# EAGLE design zero_board (EAGLE 6.6.0)
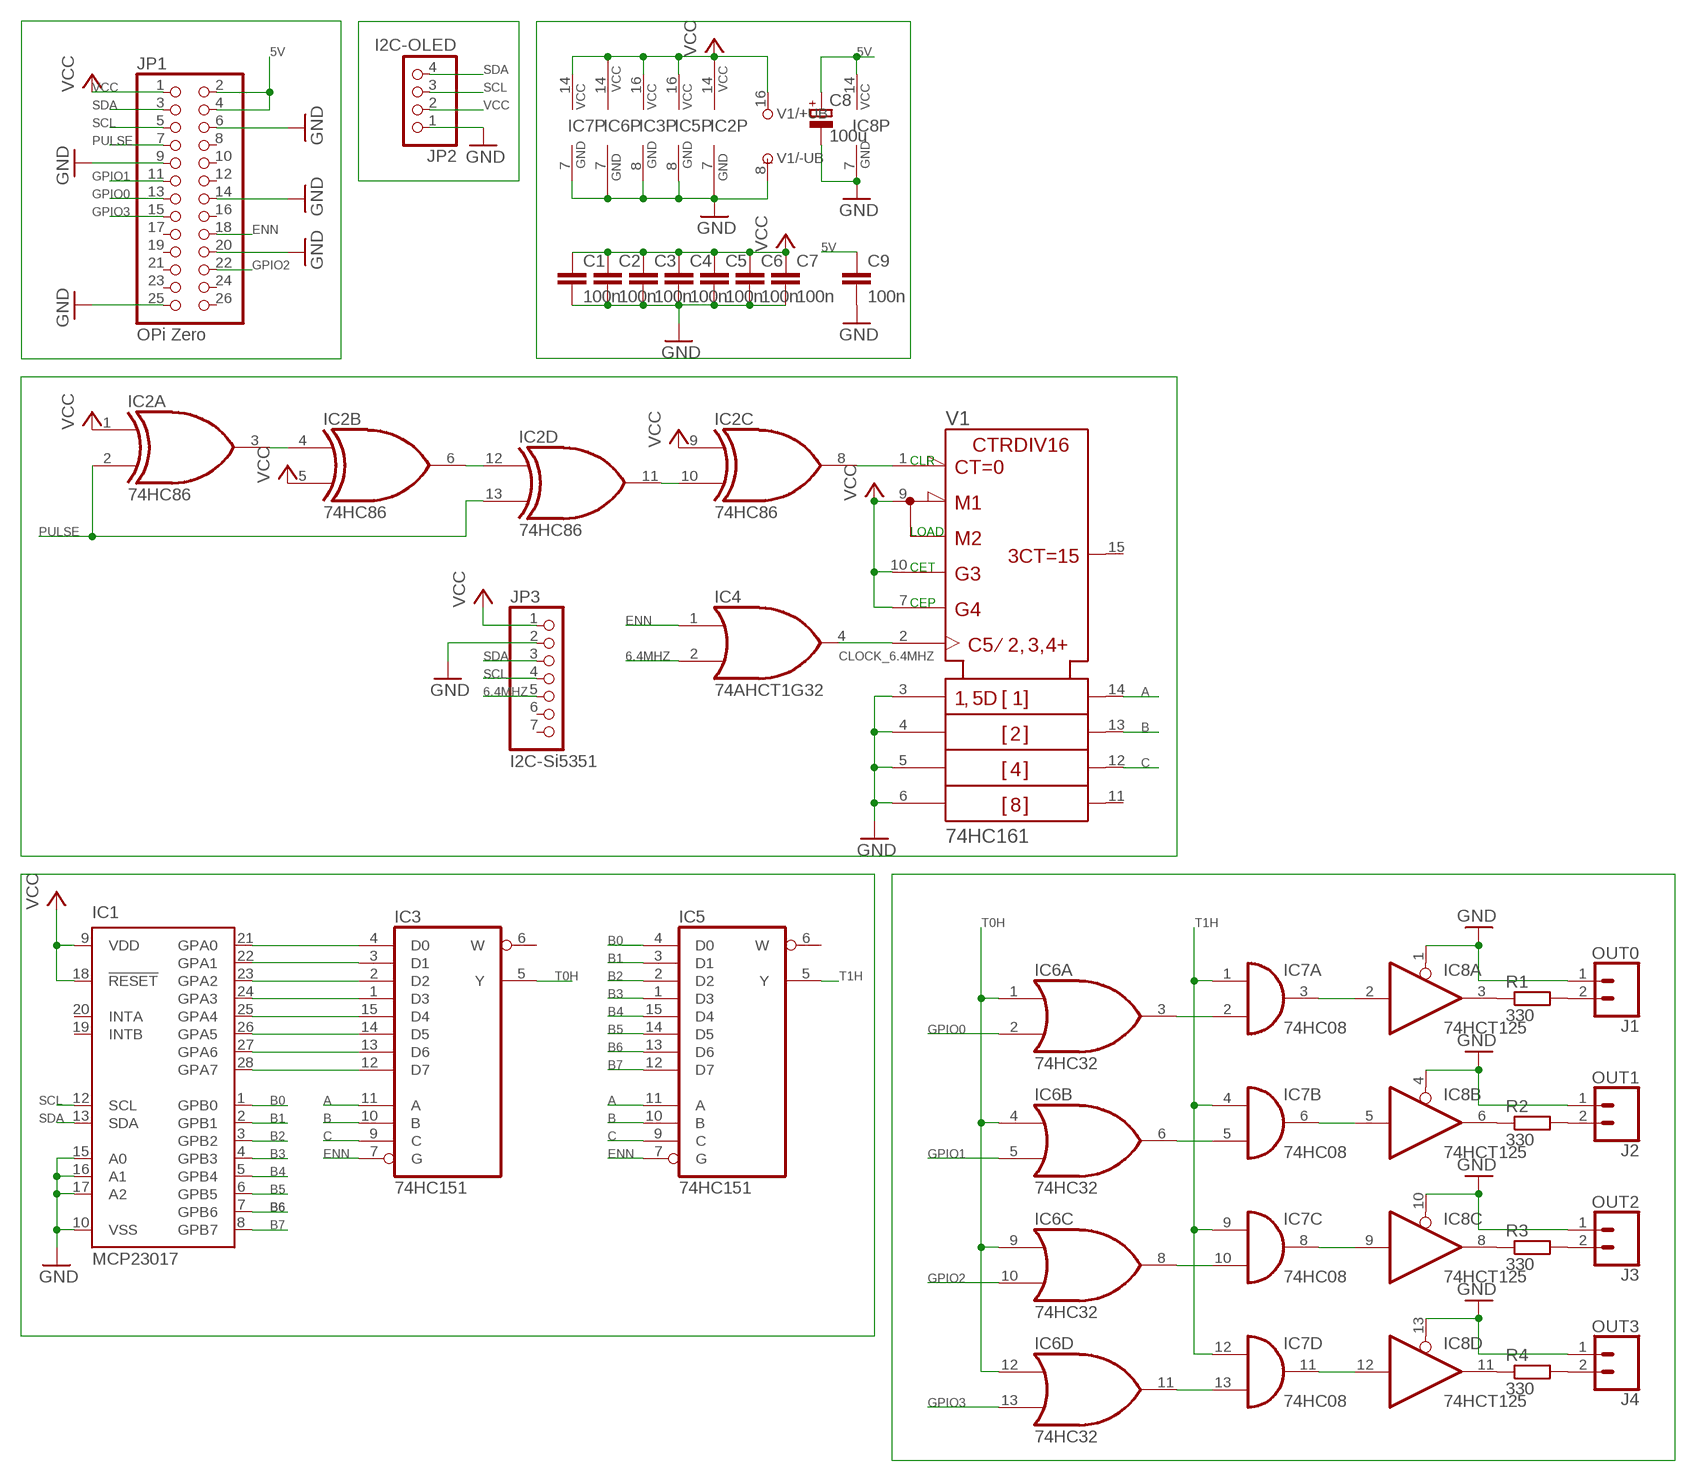
[diagram p0: schematic, sheet 1]

## Parts
C1  100n  C-EU050-024X044  [C050-024X044]
C2  100n  C-EU050-024X044  [C050-024X044]
C3  100n  C-EU050-024X044  [C050-024X044]
C4  100n  C-EU050-024X044  [C050-024X044]
C5  100n  C-EU050-024X044  [C050-024X044]
C6  100n  C-EU050-024X044  [C050-024X044]
C7  100n  C-EU050-024X044  [C050-024X044]
C8  100u  CPOL-EUE2.5-6  [E2,5-6]
C9  100n  C-EU050-024X044  [C050-024X044]
IC1  MCP23017  MCP23017SP  [DIL28-3]
IC2  74HC86  74LS86N  [DIL14]
IC3  74HC151  74HC151N  [DIL16]
IC4  74AHCT1G32  74AHCT1G32DBV  [SOT23-5]
IC5  74HC151  74HC151N  [DIL16]
IC6  74HC32  74LS32N  [DIL14]
IC7  74HC08  74AS08N  [DIL14]
IC8  74HCT125  74HC125N  [DIL14]
J1  OUT0  CONN_023.5MM  [SCREWTERMINAL-3.5MM-2]
J2  OUT1  CONN_023.5MM  [SCREWTERMINAL-3.5MM-2]
J3  OUT2  CONN_023.5MM  [SCREWTERMINAL-3.5MM-2]
J4  OUT3  CONN_023.5MM  [SCREWTERMINAL-3.5MM-2]
JP1  OPi Zero  PINHD-2X13  [2X13]
JP2  I2C-OLED  PINHD-1X4  [1X04]
JP3  I2C-Si5351  PINHD-1X7  [1X07]
R1  330  R-EU_0204/5  [0204/5]
R2  330  R-EU_0204/5  [0204/5]
R3  330  R-EU_0204/5  [0204/5]
R4  330  R-EU_0204/5  [0204/5]
V1  74HC161  74161N  [DIL16]

## Nets
5V: C8.+ C9.1 IC8.14(P:VCC) JP1.2 JP1.4
6.4MHZ: IC4.2(I1) JP3.5
A: IC3.11(A) IC5.11(A) V1.14(QA)
B: IC3.10(B) IC5.10(B) V1.13(QB)
B0: IC1.1(GPB0) IC5.4(D0)
B1: IC1.2(GPB1) IC5.3(D1)
B2: IC1.3(GPB2) IC5.2(D2)
B3: IC1.4(GPB3) IC5.1(D3)
B4: IC1.5(GPB4) IC5.15(D4)
B5: IC1.6(GPB5) IC5.14(D5)
B6: IC1.7(GPB6) IC5.13(D6)
B7: IC1.8(GPB7) IC5.12(D7)
C: IC3.9(C) IC5.9(C) V1.12(QC)
CLOCK_6.4MHZ: IC4.4(O) V1.2(CLK)
ENN: IC3.7(G) IC4.1(I0) IC5.7(G) JP1.18
GND: C1.2 C2.2 C3.2 C4.2 C5.2 C6.2 C7.2 C8.- C9.2 IC1.10(VSS) IC1.15(A0) IC1.16(A1) IC1.17(A2) IC2.7(P:GND) IC3.8(GND) IC5.8(GND) IC6.7(P:GND) IC7.7(P:GND) IC8.1(A:OE) IC8.4(B:OE) IC8.7(P:GND) IC8.10(C:OE) IC8.13(D:OE) J1.1 J2.1 J3.1 J4.1 JP1.6 JP1.9 JP1.14 JP1.20 JP1.25 JP2.1 JP3.2 V1.3(A) V1.4(B) V1.5(C) V1.6(D) V1.8(-UB)
GPIO0: IC6.2(A:I1) JP1.13
GPIO1: IC6.5(B:I1) JP1.11
GPIO2: IC6.10(C:I1) JP1.22
GPIO3: IC6.13(D:I1) JP1.15
N$1: IC2.3(A:O) IC2.4(B:I0)
N$2: IC2.6(B:O) IC2.12(D:I0)
N$3: IC2.10(C:I1) IC2.11(D:O)
N$4: IC2.8(C:O) V1.1(!CLR)
N$5: IC6.3(A:O) IC7.2(A:I1)
N$6: IC6.6(B:O) IC7.5(B:I1)
N$7: IC1.21(GPA0) IC3.4(D0)
N$8: IC1.22(GPA1) IC3.3(D1)
N$9: IC1.23(GPA2) IC3.2(D2)
N$10: IC1.24(GPA3) IC3.1(D3)
N$11: IC1.25(GPA4) IC3.15(D4)
N$12: IC1.26(GPA5) IC3.14(D5)
N$13: IC1.27(GPA6) IC3.13(D6)
N$14: IC1.28(GPA7) IC3.12(D7)
N$15: IC6.8(C:O) IC7.10(C:I1)
N$16: IC6.11(D:O) IC7.13(D:I1)
N$17: IC7.11(D:O) IC8.12(D:I)
N$18: IC7.8(C:O) IC8.9(C:I)
N$19: IC7.6(B:O) IC8.5(B:I)
N$20: IC7.3(A:O) IC8.2(A:I)
N$21: IC8.3(A:O) R1.1
N$22: J1.2 R1.2
N$23: IC8.6(B:O) R2.1
N$24: J2.2 R2.2
N$25: IC8.8(C:O) R3.1
N$26: J3.2 R3.2
N$27: IC8.11(D:O) R4.1
N$28: J4.2 R4.2
PULSE: IC2.2(A:I1) IC2.13(D:I1) JP1.7
SCL: IC1.12(SCL) JP1.5 JP2.3 JP3.4
SDA: IC1.13(SDA) JP1.3 JP2.4 JP3.3
T0H: IC3.5(Y) IC6.1(A:I0) IC6.4(B:I0) IC6.9(C:I0) IC6.12(D:I0)
T1H: IC5.5(Y) IC7.1(A:I0) IC7.4(B:I0) IC7.9(C:I0) IC7.12(D:I0)
VCC: C1.1 C2.1 C3.1 C4.1 C5.1 C6.1 C7.1 IC1.9(VDD) IC1.18(!RESET) IC2.1(A:I0) IC2.5(B:I1) IC2.9(C:I0) IC2.14(P:VCC) IC3.16(VCC) IC5.16(VCC) IC6.14(P:VCC) IC7.14(P:VCC) JP1.1 JP2.2 JP3.1 V1.7(ENP) V1.9(!LOAD) V1.10(ENT) V1.16(+UB)
Unconnected: IC1.19(INTB) IC1.20(INTA) IC3.6(W) IC5.6(W) JP1.8 JP1.10 JP1.12 JP1.16 JP1.17 JP1.19 JP1.21 JP1.23 JP1.24 JP1.26 JP3.6 JP3.7 V1.11(QD) V1.15(RCO)

## Notes on the sheet
- CLR
- LOAD
- CET
- CEP

## Power pins joined to a net without a drawn wire
GND: IC4.3(GND)
VCC: IC4.5(VCC)

## Library data of the parts
C1-C7 C9 = rcl:C-EU: CAPACITOR, European symbol
C8 = rcl:CPOL-EU: POLARIZED CAPACITOR, European symbol
IC1 = microchip:MCP23017: http://ww1.microchip.com/downloads/en/DeviceDoc/21952a.pdf Source: http://ww1.microchip.com/downloads/en/DeviceDoc/21952a.pdf; MF: MICROCHIP; MPN: MCP23017-E/SP; OC_FARNELL: 1332088; OC_NEWARK: 31K2959
IC2 = 74xx-us:74*86: Quad 2-input EXCLUSIV-OR (XOR) gate
IC3 IC5 = 74xx-eu:74*151: Data SELECTOR/MULTIPLEXER
IC4 = 74xx-little-us:74*1G32: 2-input OR gate
IC6 = 74xx-us:74*32: Quad 2-input OR gate
IC7 = 74xx-eu:74*08: Quad 2-input AND gate
IC8 = 74xx-eu:74*125: Quad bus BUFFER, 3-state
J1-J4 = SparkFun-Connectors:CONN_02: Multi connection point. Often used as Generic Header-pin footprint for 0.1 inch spaced/style header connections On any of the 0.1 inch spaced packages, you can populate with these: Break Away Headers - Straight <https://www.sparkfun.com/products/116> (PRT-00116) Break Away Male Headers - Right Angle <https://www.sparkfun.com/products/553> (PRT-00553) Female Headers <https://www.sparkfun.com/products/115> (PRT-00115) Break Away Headers - Machine Pin <https://www.sparkfun.com/products/117> (PRT-00117) Break Away Female Headers - Swiss Machine Pin <https://www.sparkfun.com/products/743> (PRT-00743) For SCREWTERMINALS and SPRING TERMINALS visit here: Screw Terimnals on SparkFun.com <https://www.sparkfun.com/search/results?term=Screw+Terminals> (5mm/3.5mm/2.54mm spacing) This device is also useful as a general connection point to wire up your design to another part of your project. Our various solder wires solder well into these plated through hole pads. Hook-Up Wire - Assortment (Stranded, 22 AWG) <https://www.sparkfun.com/products/11375> (PRT-11375) Hook-Up Wire - Assortment (Solid Core, 22 AWG) <https://www.sparkfun.com/products/11367> (PRT-11367) View the entire wire category on our website here <https://www.sparkfun.com/categories/141> Special notes: Molex polarized connector foot print use with: PRT-08233 with associated crimp pins and housings. 2.54_SCREWTERM for use with PRT-10571. 3.5mm Screw Terminal footprints for PRT-08084 5mm Screw Terminal footprints for use with PRT-08432; PROD_ID: CONN-08399
JP1 = pinhead:PINHD-2X13: PIN HEADER
JP2 = pinhead:PINHD-1X4: PIN HEADER
JP3 = pinhead:PINHD-1X7: PIN HEADER
R1-R4 = resistor:R-EU_: RESISTOR, European symbol
V1 = 74ttl-din:74*161: Synchrounus 4-bit COUNTER

## Board
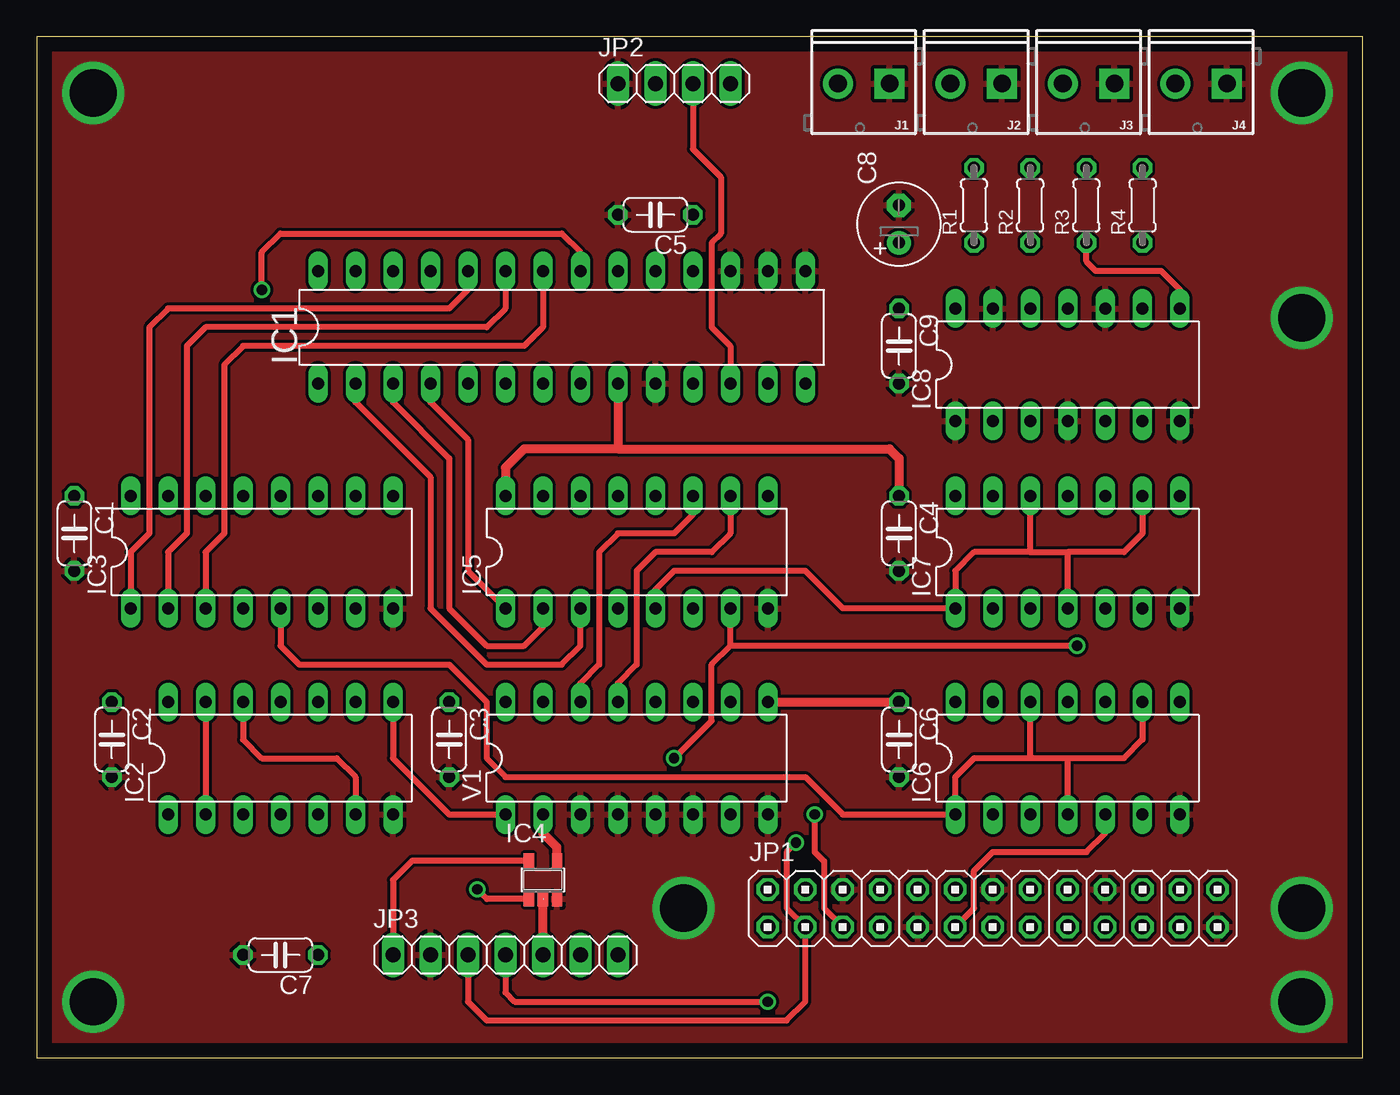
[diagram p1: board, top side]
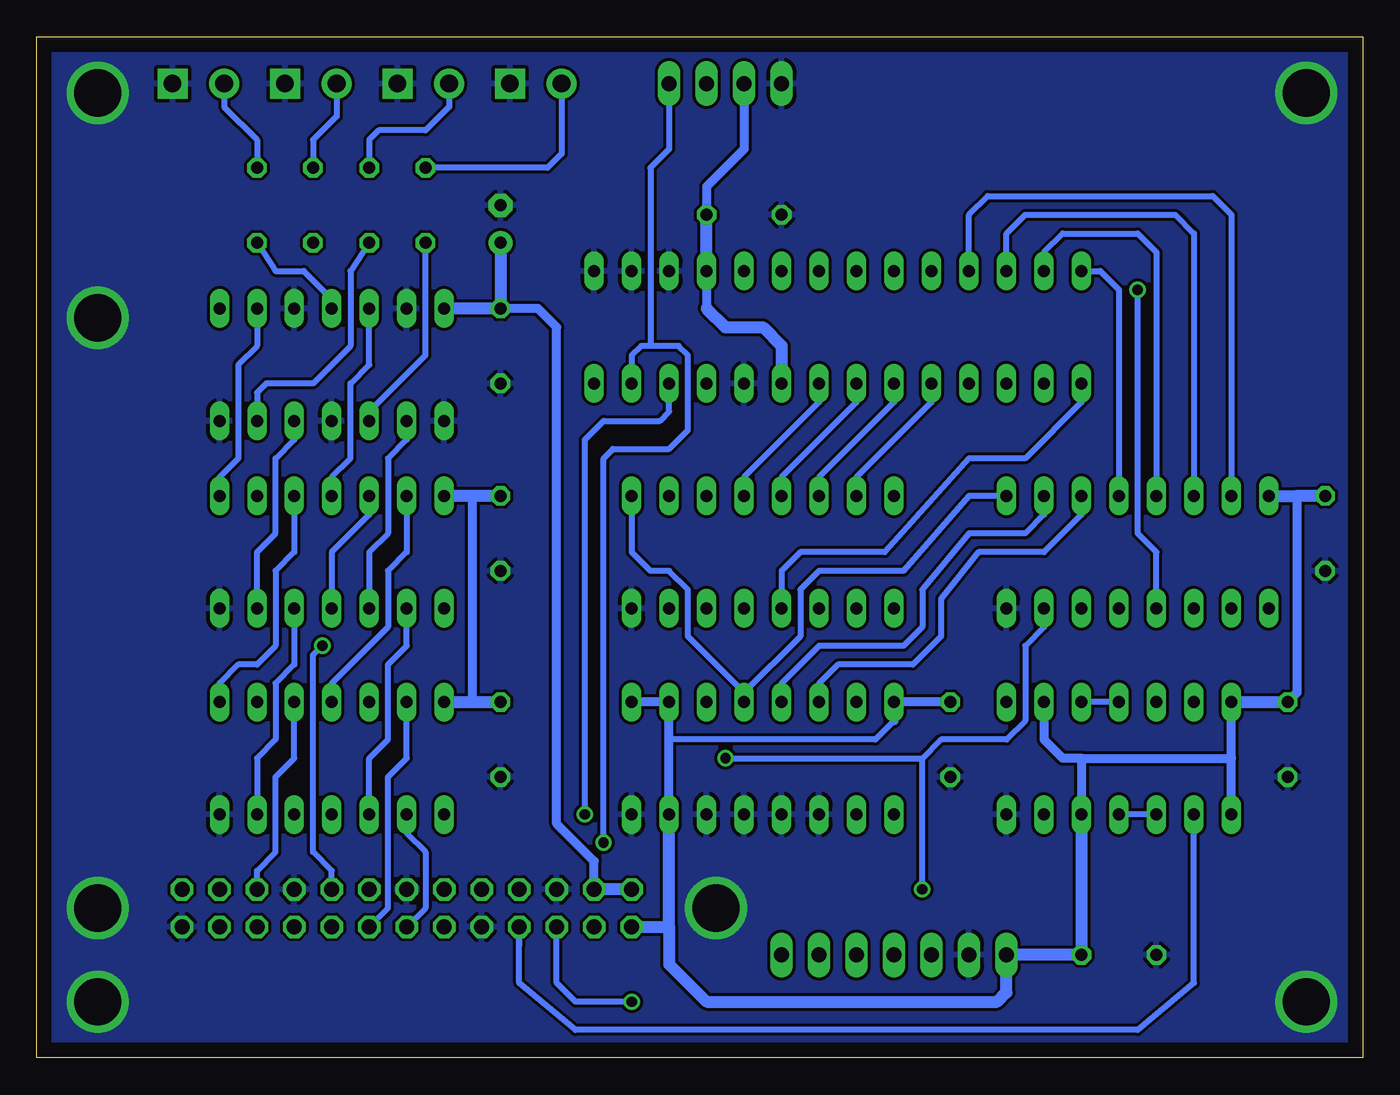
[diagram p2: board, bottom side, seen from below]

Size 89.84 x 69.2 mm. Coordinates in mm from the lower left corner, seen from the top.
Outline: 0,0 89.84,0 89.84,69.2 0,69.2 0,0
Copper layers (1*16): Top 0.035mm / dielectric 1.5mm / Bottom 0.035mm
Design rules "default": minimum track width 10mil, minimum drill 24mil, track to track 8mil, track to pad 8mil, pad to pad 8mil, via to via 8mil, smd to smd 8mil, copper to edge 40mil, drill to drill 8mil, minimum pad ring 10mil, minimum via ring 8mil, stop-mask expansion 4mil, vias tented up to drill 0mil, thermal gap 10mil

### Footprints (pad centres in the part's own frame; a part is rotated, then mirrored left to right if it is on the bottom)
C050-024X044 = drill 0.813 octagon: 1 -2.54,0; 2 2.54,0
E2,5-6 = drill 0.813 pad 1.6: + -1.27,0 | drill 0.813 pad 1.6 octagon: - 1.27,0
DIL28-3 = drill 0.813 long: 1 -16.51,-3.81; 2 -13.97,-3.81; 3 -11.43,-3.81; 4 -8.89,-3.81; 5 -6.35,-3.81; 6 -3.81,-3.81; 7 -1.27,-3.81; 8 1.27,-3.81; 9 3.81,-3.81; 10 6.35,-3.81; 11 8.89,-3.81; 12 11.43,-3.81; 13 13.97,-3.81; 14 16.51,-3.81; 15 16.51,3.81; 16 13.97,3.81; 17 11.43,3.81; 18 8.89,3.81; 19 6.35,3.81; 20 3.81,3.81; 21 1.27,3.81; 22 -1.27,3.81; 23 -3.81,3.81; 24 -6.35,3.81; 25 -8.89,3.81; 26 -11.43,3.81; 27 -13.97,3.81; 28 -16.51,3.81
DIL14 = drill 0.813 long: 1 -7.62,-3.81; 2 -5.08,-3.81; 3 -2.54,-3.81; 4 0,-3.81; 5 2.54,-3.81; 6 5.08,-3.81; 7 7.62,-3.81; 8 7.62,3.81; 9 5.08,3.81; 10 2.54,3.81; 11 0,3.81; 12 -2.54,3.81; 13 -5.08,3.81; 14 -7.62,3.81
DIL16 = drill 0.813 long: 1 -8.89,-3.81; 2 -6.35,-3.81; 3 -3.81,-3.81; 4 -1.27,-3.81; 5 1.27,-3.81; 6 3.81,-3.81; 7 6.35,-3.81; 8 8.89,-3.81; 9 8.89,3.81; 10 6.35,3.81; 11 3.81,3.81; 12 1.27,3.81; 13 -1.27,3.81; 14 -3.81,3.81; 15 -6.35,3.81; 16 -8.89,3.81
SOT23-5 = smd 0.69 x 0.99: 1 -0.95,-1.29; 2 0,-1.29; 3 0.95,-1.29; 4 0.95,1.3; 5 -0.95,1.3
SCREWTERMINAL-3.5MM-2 = drill 1.2 pad 2.032 square: 1 0,0 | drill 1.2 pad 2.032: 2 3.5,0
2X13 = drill 1.016 octagon: 1 -15.24,-1.27; 2 -15.24,1.27; 3 -12.7,-1.27; 4 -12.7,1.27; 5 -10.16,-1.27; 6 -10.16,1.27; 7 -7.62,-1.27; 8 -7.62,1.27; 9 -5.08,-1.27; 10 -5.08,1.27; 11 -2.54,-1.27; 12 -2.54,1.27; 13 0,-1.27; 14 0,1.27; 15 2.54,-1.27; 16 2.54,1.27; 17 5.08,-1.27; 18 5.08,1.27; 19 7.62,-1.27; 20 7.62,1.27; 21 10.16,-1.27; 22 10.16,1.27; 23 12.7,-1.27; 24 12.7,1.27; 25 15.24,-1.27; 26 15.24,1.27
1X04 = drill 1.016 long: 1 -3.81,0; 2 -1.27,0; 3 1.27,0; 4 3.81,0
1X07 = drill 1.016 long: 1 -7.62,0; 2 -5.08,0; 3 -2.54,0; 4 0,0; 5 2.54,0; 6 5.08,0; 7 7.62,0
0204/5 = drill 0.813 octagon: 1 -2.54,0; 2 2.54,0

### Placement (x,y rotation side)
C1  2.54,35.56 270 top
C2  5.08,21.59 270 top
C3  27.94,21.59 270 top
C4  58.42,35.56 270 top
C5  41.91,57.15 180 top
C6  58.42,21.59 270 top
C7  16.51,6.99 180 top
C8  58.42,56.52 90 top
C9  58.42,48.26 270 top
IC1  35.56,49.53 0 top
IC2  16.51,20.32 0 top
IC3  15.24,34.29 0 top
IC4  34.29,12.07 0 top
IC5  40.64,34.29 0 top
IC6  69.85,20.32 0 top
IC7  69.85,34.29 0 top
IC8  69.85,46.99 0 top
J1  57.78,66.04 180 top
J2  65.41,66.04 180 top
J3  73.03,66.04 180 top
J4  80.65,66.04 180 top
JP1  64.77,10.16 0 top
JP2  43.18,66.04 0 top
JP3  31.75,6.99 0 top
R1  63.5,57.78 90 top
R2  67.31,57.78 90 top
R3  71.12,57.78 90 top
R4  74.93,57.78 90 top
V1  40.64,20.32 0 top

### Tracks (layer width: path | path; a pad name or v marks a point on that pad's centre or on a via)
5V
  Bottom 0.61: JP1.4 52.07,13.34 54.61,15.88 54.61,49.53 55.88,50.8 C9.1
  Bottom 0.813: IC8.14 C9.1 C8.+ | JP1.2 JP1.4
6.4MHZ
  Top 0.61: JP3.5 IC4.2
A
  Top 0.406: IC5.11 44.45,36.83 43.18,35.56 39.37,35.56 38.1,34.29 38.1,26.67 36.83,25.4 V1.14
  Bottom 0.406: IC3.11 19.05,36.83 21.59,34.29 26.04,34.29 28.58,31.12 28.58,28.57 30.48,26.67 35.56,26.67 36.83,25.4 V1.14
B
  Top 0.406: IC5.10 46.99,35.56 45.72,34.29 41.91,34.29 40.64,33.02 40.64,26.67 39.37,25.4 V1.13
  Bottom 0.406: IC3.10 21.59,36.83 22.86,35.56 26.67,35.56 29.85,31.75 29.85,29.21 31.12,27.94 36.83,27.94 39.37,25.4 V1.13
B0
  Bottom 0.406: IC1.1 19.05,44.45 22.86,40.64 26.67,40.64 32.38,34.29 38.1,34.29 39.37,33.02 IC5.4
B1
  Top 0.406: IC5.3 36.83,27.94 35.56,26.67 30.48,26.67 26.67,30.48 26.67,39.37 21.59,44.45 IC1.2
B2
  Top 0.406: IC5.2 34.29,29.21 33.02,27.94 30.48,27.94 27.94,30.48 27.94,40.64 24.13,44.45 IC1.3
B3
  Top 0.406: IC1.4 26.67,44.45 29.21,41.91 29.21,33.02 IC5.1
B4
  Bottom 0.406: IC1.5 29.21,44.45 34.29,39.37 IC5.15
B5
  Bottom 0.406: IC1.6 31.75,44.45 36.83,39.37 IC5.14
B6
  Bottom 0.406: IC1.7 34.29,44.45 39.37,39.37 IC5.13
B7
  Bottom 0.406: IC1.8 36.83,44.45 41.91,39.37 IC5.12
C
  Bottom 0.406: IC3.9 26.67,38.1 31.12,33.02 36.83,33.02 38.1,31.75 38.1,28.57 41.91,24.77 | IC5.9 49.53,34.29 48.26,33.02 46.99,33.02 45.72,31.75 45.72,28.57 41.91,24.77 | 41.91,24.77 V1.12
CLOCK_6.4MHZ
  Top 0.61: IC4.4 35.24,14.29 34.29,15.24 V1.2
ENN  (via drill 0.7)
  Top 0.406: 46.99,27.94 45.72,26.67 45.72,22.86 v43.18,20.32 | 46.99,27.94 IC5.7 | v70.48,27.94 46.99,27.94 | IC4.1 30.5,10.78 v29.85,11.43
  Bottom 0.406: IC3.7 21.59,29.21 22.86,27.94 22.86,22.86 24.13,21.59 28.58,21.59 29.85,20.32 | v43.18,20.32 29.85,20.32 | JP1.18 69.85,12.7 71.12,13.97 71.12,27.3 v70.48,27.94 | v29.85,11.43 29.85,20.32
GND  (via drill 3.2)
  other vias: 85.73,3.81 3.81,3.81 3.81,65.41 85.73,65.41 85.73,10.16 43.81,10.16 85.73,50.16
  pour Bottom: -1.27,-0.64 90.81,-0.64 90.81,69.85 -0.64,69.85
  pour Top: -0.64,-0.64 90.17,-0.64 90.17,69.22 -0.64,69.22
GPIO0
  Bottom 0.406: IC6.2 64.77,15.24 63.5,13.97 63.5,10.16 JP1.13
GPIO1
  Top 0.406: JP1.11 63.5,10.16 63.5,12.7 64.77,13.97 71.12,13.97 72.39,15.24 IC6.5
GPIO2
  Bottom 0.406: JP1.22 74.93,12.7 73.66,13.97 73.66,19.05 72.39,20.32 IC6.10
GPIO3
  Bottom 0.406: JP1.15 66.04,10.16 66.04,19.05 64.77,20.32 IC6.13
N$1
  Bottom 0.406: IC2.3 IC2.4
N$2
  Top 0.406: IC2.12 13.97,21.59 15.24,20.32 20.32,20.32 21.59,19.05 IC2.6
N$3
  Bottom 0.406: IC2.11 IC2.10
N$4
  Top 0.406: IC2.8 24.13,20.32 27.94,16.51 V1.1
N$5
  Bottom 0.406: IC6.3 67.31,20.32 66.04,21.59 66.04,26.67 64.77,27.94 IC7.2
N$6
  Bottom 0.406: IC7.5 72.39,26.67 73.66,25.4 73.66,21.59 74.93,20.32 IC6.6
N$7  (via drill 0.7)
  Top 0.406: v15.24,52.07 15.24,54.61 16.51,55.88 35.56,55.88 36.83,54.61 IC1.21
  Bottom 0.406: IC3.4 13.97,34.29 15.24,35.56 v15.24,52.07
N$8
  Top 0.406: IC1.22 34.29,49.53 33.02,48.26 13.97,48.26 12.7,46.99 12.7,35.56 11.43,34.29 IC3.3
N$9
  Top 0.406: IC1.23 31.75,50.8 30.48,49.53 11.43,49.53 10.16,48.26 10.16,35.56 8.89,34.29 IC3.2
N$10
  Top 0.406: IC1.24 29.21,52.07 27.94,50.8 8.89,50.8 7.62,49.53 7.62,35.56 6.35,34.29 IC3.1
N$11
  Bottom 0.406: IC1.25 26.67,57.15 25.4,58.42 10.16,58.42 8.89,57.15 IC3.15
N$12
  Bottom 0.406: IC1.26 24.13,55.88 22.86,57.15 12.7,57.15 11.43,55.88 IC3.14
N$13
  Bottom 0.406: IC1.27 21.59,54.61 20.32,55.88 15.24,55.88 13.97,54.61 IC3.13
N$14
  Bottom 0.406: IC1.28 17.78,53.34 16.51,52.07 IC3.12
N$15
  Bottom 0.406: IC7.10 72.39,34.29 73.66,33.02 73.66,27.94 74.93,26.67 76.2,26.67 77.47,25.4 IC6.8
N$16
  Bottom 0.406: IC7.13 64.77,34.29 66.04,33.02 66.04,29.21 69.85,25.4 IC6.11
N$17
  Bottom 0.406: IC7.11 69.85,39.37 68.58,40.64 68.58,45.72 67.31,46.99 IC8.12
N$18
  Bottom 0.406: IC7.8 77.47,39.37 76.2,40.64 76.2,46.99 74.93,48.26 IC8.9
N$19
  Bottom 0.406: IC7.6 74.93,34.29 73.66,35.56 73.66,40.64 72.39,41.91 IC8.5
N$20
  Bottom 0.406: IC8.2 64.77,41.91 66.04,40.64 66.04,35.56 67.31,34.29 IC7.3
N$21
  Bottom 0.406: IC8.3 67.31,43.81 63.5,47.62 R1.1
N$22
  Bottom 0.406: J1.2 54.28,61.28 55.24,60.32 R1.2
N$23
  Bottom 0.406: R2.1 68.58,53.34 68.58,48.26 71.12,45.72 74.3,45.72 74.93,45.09 IC8.6
N$24
  Bottom 0.406: J2.2 61.91,64.46 63.5,62.86 66.68,62.86 67.31,62.23 R2.2
N$25
  Top 0.406: IC8.8 77.47,52.07 76.2,53.34 71.76,53.34 71.12,53.98 R3.1
N$26
  Bottom 0.406: J3.2 69.53,63.83 71.12,62.23 R3.2
N$27
  Bottom 0.406: IC8.11 69.85,51.44 71.76,53.34 73.66,53.34 R4.1
N$28
  Bottom 0.406: J4.2 77.15,64.44 74.93,62.23 R4.2
PULSE
  Top 0.406: IC2.13 IC2.2
  Bottom 0.406: 57.15,7.62 JP1.7 57.15,5.08 53.34,1.91 15.24,1.91 11.43,5.08 IC2.2
SCL  (via drill 0.7)
  Top 0.406: JP3.4 31.75,4.44 32.38,3.81 v49.53,3.81 | v52.7,16.51 52.7,13.97 53.34,13.34 53.34,10.16 JP1.5 | JP2.3 44.45,61.59 46.35,59.69 46.35,55.88 45.72,55.24 45.72,49.53 46.99,48.26 IC1.12
  Bottom 0.406: v49.53,3.81 53.34,3.81 54.61,5.08 JP1.5 | v52.7,16.51 52.7,41.91 51.43,43.18 47.62,43.18 46.99,43.81 IC1.12
SDA  (via drill 0.7)
  Top 0.406: JP3.3 29.21,3.81 30.48,2.54 50.8,2.54 52.07,3.81 JP1.3 50.8,10.16 50.8,13.97 v51.43,14.61
  Bottom 0.406: v51.43,14.61 51.43,40.64 50.8,41.27 46.99,41.27 45.72,42.55 45.72,47.62 46.35,48.26 48.26,48.26 | 48.26,48.26 48.89,48.26 49.53,47.62 IC1.13 | JP2.4 46.99,61.59 48.26,60.32 48.26,48.26
T0H
  Top 0.406: IC6.4 69.85,20.32 | 67.31,20.32 IC6.12 | IC6.9 74.93,21.59 73.66,20.32 69.85,20.32 | IC3.5 16.51,27.94 17.78,26.67 27.94,26.67 30.48,24.13 30.48,20.32 31.75,19.05 52.07,19.05 54.61,16.51 IC6.1 62.23,19.05 63.5,20.32 67.31,20.32 | 69.85,20.32 67.31,20.32
T1H
  Top 0.406: IC7.9 74.93,35.56 73.66,34.29 69.85,34.29 | 67.31,34.29 IC7.12 | 67.31,34.29 69.85,34.29 | IC7.4 69.85,34.29 | 67.31,34.29 63.5,34.29 62.23,33.02 IC7.1 54.61,30.48 52.07,33.02 43.18,33.02 41.91,31.75 IC5.5
  Bottom 0.406: IC7.12 67.31,36.83 69.85,34.29 IC7.4
VCC
  Top 0.406: IC4.5 25.43,13.37 24.13,12.07 JP3.1
  Top 0.61: IC1.9 39.37,41.27 | 39.37,41.27 33.02,41.27 31.75,40 IC5.16 | 39.37,41.27 57.78,41.27 58.42,40.64 C4.1 | V1.9 C6.1
  Bottom 0.406: 46.99,21.59 33.02,21.59 31.75,22.86
  Bottom 0.61: IC1.18 44.45,50.8 | 19.05,20.32 IC2.5 | IC2.1 8.89,20.32 | 19.05,20.32 8.89,20.32 | V1.9 V1.10 46.99,21.59 V1.7 | IC2.9 21.59,21.59 20.32,20.32 19.05,20.32 | 8.89,20.32 IC2.14 | C3.1 V1.16 31.75,22.86 | JP2.2 41.91,61.59 44.45,59.05 C5.1 | 60.32,24.13 60.32,38.1 | 4.45,38.1 4.45,24.77 C2.1
  Bottom 0.813: 44.45,50.8 43.18,49.53 40.64,49.53 39.37,48.26 IC1.9 | C1.1 4.45,38.1 IC3.16 | IC2.14 C2.1 | IC2.5 C7.1 JP3.1 24.13,4.44 24.77,3.81 44.45,3.81 46.99,6.35 46.99,8.89 | IC1.18 C5.1 | C6.1 60.32,24.13 IC6.14 | C4.1 60.32,38.1 IC7.14 | JP1.1 46.99,8.89 | 46.99,8.89 V1.7